# EAGLE design SSOP to DIP 8 pin (EAGLE 5.06)
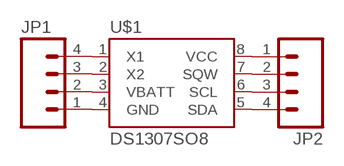
[diagram p0: schematic, sheet 1]

## Parts
JP1  M04LOCK  [1X04_LOCK]
JP2  M04LOCK  [1X04_LOCK]
U$1  DS1307SO8  [SO08]

## Nets
N$1: JP1.1 U$1.4(GND)
N$2: JP1.2 U$1.3(VBATT)
N$3: JP1.3 U$1.2(X2)
N$4: JP1.4 U$1.1(X1)
N$5: JP2.1 U$1.8(VCC)
N$6: JP2.2 U$1.7(SQW)
N$7: JP2.3 U$1.6(SCL)
N$8: JP2.4 U$1.5(SDA)

## Library data of the parts
JP1 JP2 = SparkFun:M04: Header 4 Standard 4-pin 0.1" header. Use with straight break away headers (SKU : PRT-00116), right angle break away headers (PRT-00553), swiss pins (PRT-00743), machine pins (PRT-00117), and female headers (PRT-00115). Molex polarized connector foot print use with SKU : PRT-08231 with associated crimp pins and housings.
U$1 = SparkFun:DS1307

## Board
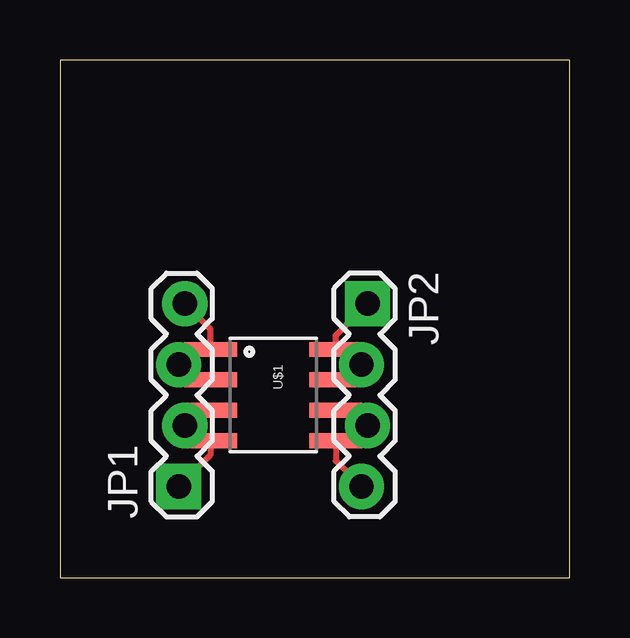
[diagram p1: board, top side]

Size 21.26 x 21.58 mm. Coordinates in mm from the lower left corner, seen from the top.
Outline: 0,0 21.26,0 21.26,21.58 0,21.58 0,0
Copper layers (1*16): Top 0.035mm / dielectric 1.5mm / Bottom 0.035mm
Design rules "default": minimum track width 10mil, minimum drill 24mil, track to track 8mil, track to pad 8mil, pad to pad 8mil, via to via 8mil, smd to smd 8mil, copper to edge 40mil, drill to drill 8mil, minimum pad ring 10mil, minimum via ring 8mil, stop-mask expansion 4mil, vias tented up to drill 0mil, thermal gap 10mil

### Footprints (pad centres in the part's own frame; a part is rotated, then mirrored left to right if it is on the bottom)
1X04_LOCK = drill 1.016 pad 1.88 square: 1 0,0.127 | drill 1.016 pad 1.88 round: 2 2.54,-0.127; 3 5.08,0.127; 4 7.62,-0.127
SO08 = smd 0.61 x 2.21: 1 -1.905,-2.616; 2 -0.635,-2.616; 3 0.635,-2.616; 4 1.905,-2.616; 5 1.905,2.616; 6 0.635,2.616; 7 -0.635,2.616; 8 -1.905,2.616

### Placement (x,y rotation side)
JP1  5.08,3.81 90 top
JP2  12.7,11.43 270 top
U$1  8.89,7.62 270 top

### Tracks (layer width: path | path; a pad name or v marks a point on that pad's centre or on a via)
N$1
  Top 0.254: U$1.4 6.27,5.13 JP1.1
N$2
  Top 0.254: U$1.3 5.84,6.99 JP1.2
N$3
  Top 0.254: U$1.2 5.59,8.26 JP1.3
N$4
  Top 0.254: U$1.1 6.27,10.36 JP1.4
N$5
  Top 0.254: U$1.8 11.51,10.11 JP2.1
N$6
  Top 0.254: U$1.7 11.94,8.26 JP2.2
N$7
  Top 0.254: U$1.6 12.19,6.99 JP2.3
N$8
  Top 0.254: U$1.5 11.51,4.88 JP2.4